# EAGLE design CC2652P_STICK_v1.1 (EAGLE 9.6.2)
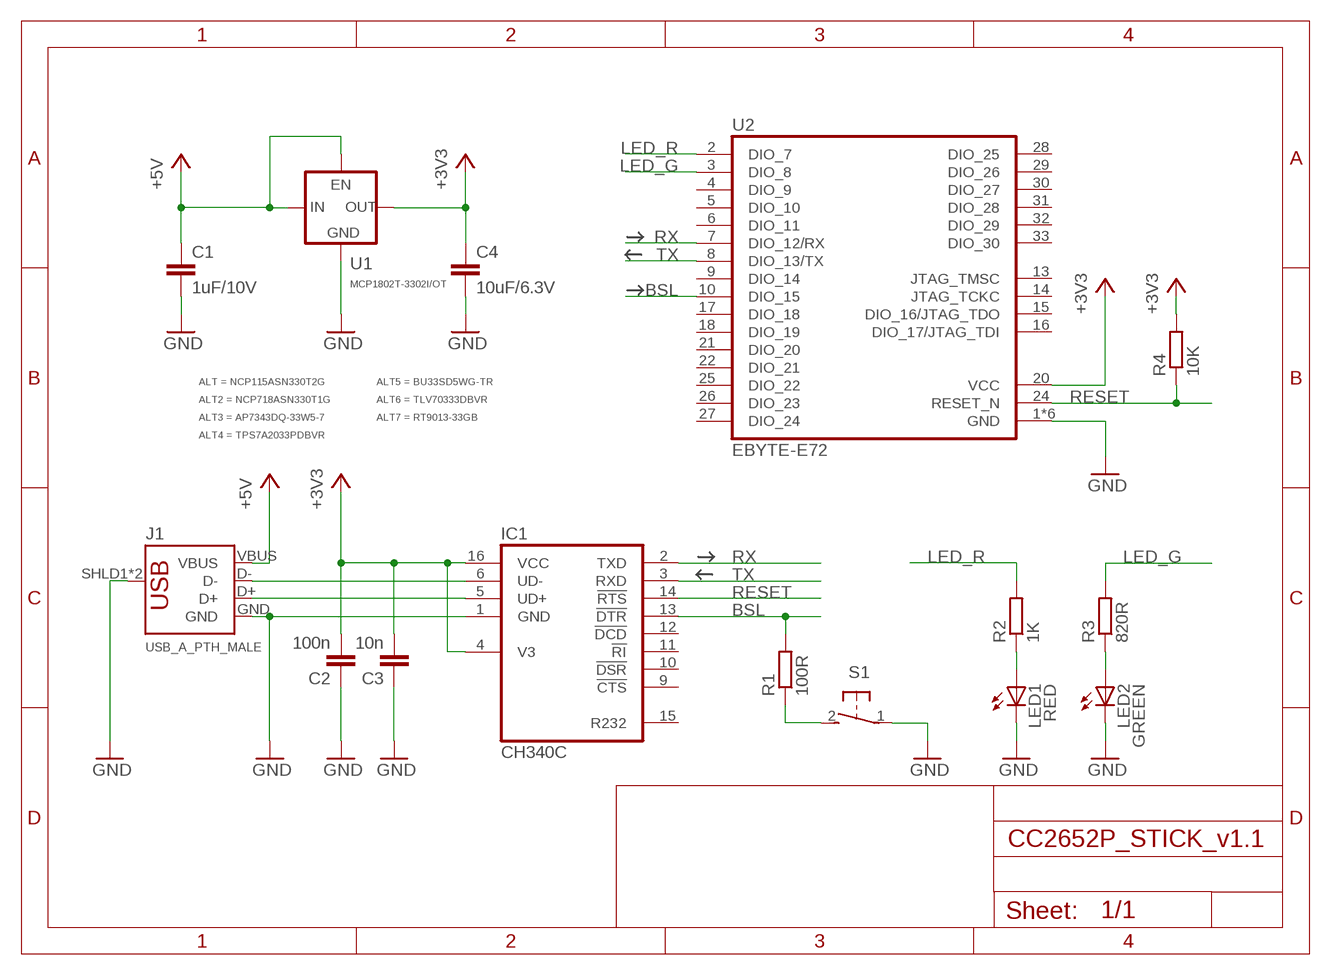
[diagram p0: schematic, sheet 1]

## Parts
C1  1uF/10V  C-EUC0805  [C0805]
C2  100n  C-EUC0805  [C0805]
C3  10n  C-EUC0805  [C0805]
C4  10uF/6.3V  C-EUC0805  [C0805]
IC1  CH340C  [SO16]
J1  USB_A_PTH_MALE  [USB-A-H]
LED1  RED  LED0603  [LED0603]
LED2  GREEN  LED0603  [LED0603]
R1  100R  R-EU_R0805  [R0805]
R2  1K  R-EU_R0805  [R0805]
R3  820R  R-EU_R0805  [R0805]
R4  10K  R-EU_R0805  [R0805]
S1  DTSM-3  [DTSM-3]
U1  MCP1802T-3302I/OT  TLV70033DD  [SOT23-5]
U2  EBYTE-E72  [EBYTE-E72]

## Nets
+3V3: C2.2 C3.2 C4.1 IC1.4(V3) IC1.16(VCC) R4.2 U1.5(VOUT) U2.20(VCC)
+5V: C1.1 J1.VBUS U1.1(VIN) U1.3(EN)
BSL: IC1.13(!DTR) R1.2 U2.10(DIO_15)
DN: IC1.6(UD-) J1.D-
DP: IC1.5(UD+) J1.D+
GND: C1.2 C2.1 C3.1 C4.2 IC1.1(GND) J1.GND J1.SHLD1(SHIELD) J1.SHLD2(SHIELD) LED1.C LED2.C S1.1 U1.2(GND) U2.1(GND) U2.11(GND) U2.12(GND) U2.19(GND) U2.23(GND) U2.34(GND)
LED_G: R3.2 U2.3(DIO_8)
LED_R: R2.2 U2.2(DIO_7)
N$1: LED2.A R3.1
N$2: LED1.A R2.1
N$3: R1.1 S1.2
RESET: IC1.14(!RTS) R4.1 U2.24(RESET_N)
RX: IC1.2(TXD) U2.7(DIO_12/RX)
TX: IC1.3(RXD) U2.8(DIO_13/TX)
Unconnected: IC1.9(!CTS) IC1.10(!DSR) IC1.11(!RI) IC1.12(!DCD) IC1.15(R232) U2.4(DIO_9) U2.5(DIO_10) U2.6(DIO_11) U2.9(DIO_14) U2.13(JTAG_TMSC) U2.14(JTAG_TCKC) U2.15(DIO_16/JTAG_TDO) U2.16(DIO_17/JTAG_TDI) U2.17(DIO_18) U2.18(DIO_19) U2.21(DIO_20) U2.22(DIO_21) U2.25(DIO_22) U2.26(DIO_23) U2.27(DIO_24) U2.28(DIO_25) U2.29(DIO_26) U2.30(DIO_27) U2.31(DIO_28) U2.32(DIO_29) U2.33(DIO_30)

## Library data of the parts
C1-C4 = rcl:C-EU: CAPACITOR, European symbol; SPICEPREFIX: C
IC1 = my-ic-usb:CH340C: USB 2.0 to Serial built-in crystal; PROD_ID: IC-13498; VALUE: CH340G
J1 = SparkFun-Connectors:USB_A: USB-A Connector Male and female variants, as well as PTH and SMT variants SparkFun Products: SparkFun XBee Explorer Dongle <https://www.sparkfun.com/products/11697> PTH Male SparkFun MicroView-USB Programmer <https://www.sparkfun.com/products/12924> SMT Male SparkFun USB Type A Female Breakout <https://www.sparkfun.com/products/12700> SMT Female; PROD_ID: CONN-08367; SF_ID: PRT-00437
LED1 LED2 = my-opto:LED
R1-R4 = rcl:R-EU_: RESISTOR, European symbol; SPICEPREFIX: R
S1 = my-switch:DTSM-3
U1 = my-power:TLV700*: LDO regulator 200mA; ALT: NCP115ASN330T2G; ALT2: NCP718ASN330T1G; ALT3: AP7343DQ-33W5-7; ALT4: TPS7A2033PDBVR; ALT5: BU33SD5WG-TR; ALT6: TLV70333DBVR; ALT7: RT9013-33GB
U2 = my-modules:EBYTE-E72: CC2652P Multifunctional SoC wireless module

## Board
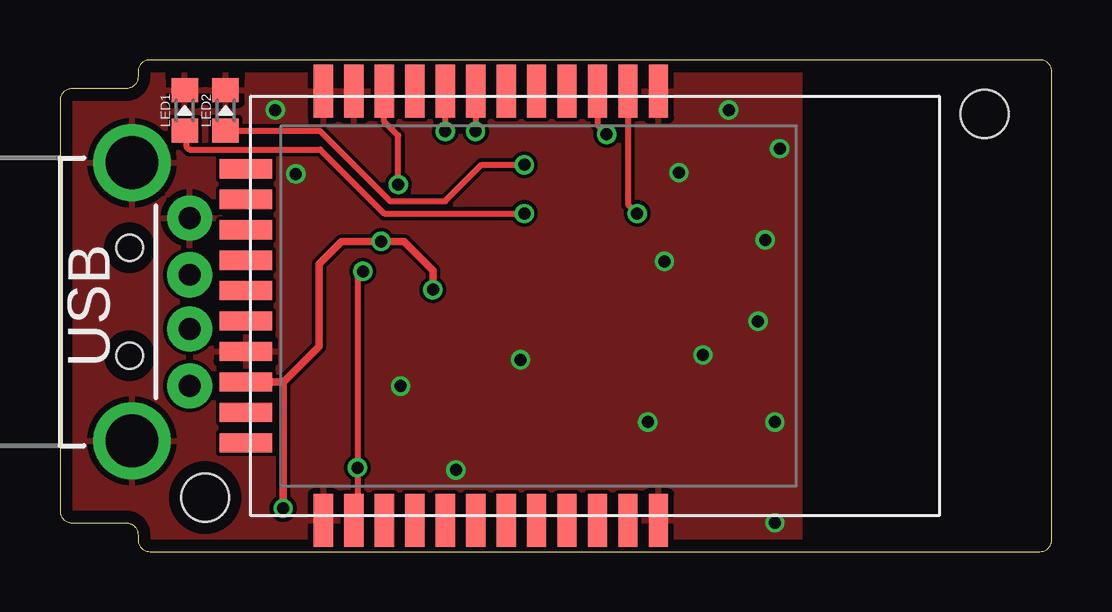
[diagram p1: board, top side]
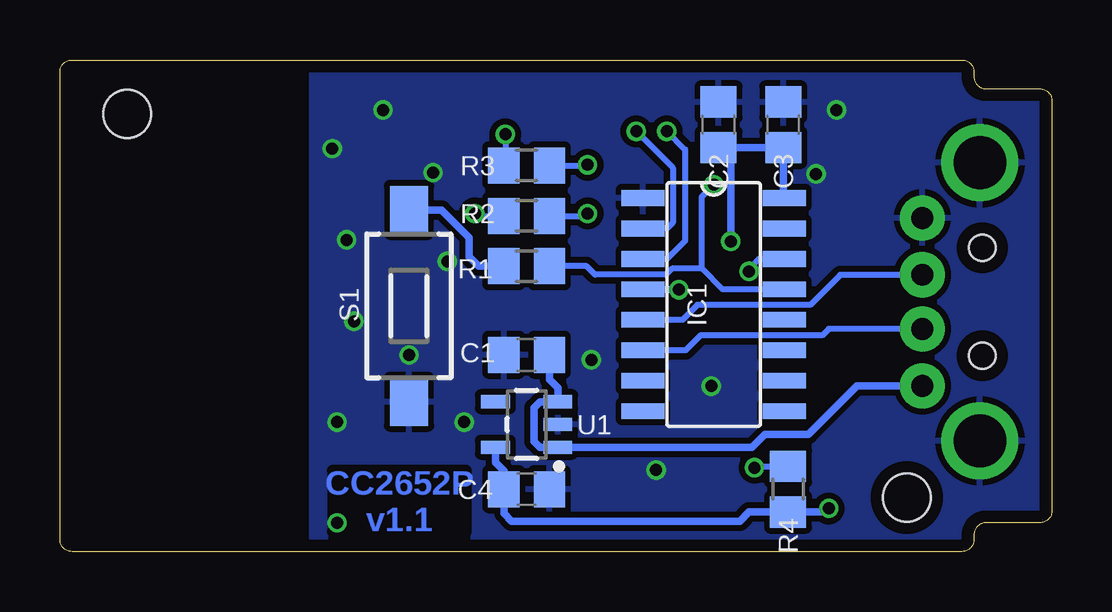
[diagram p2: board, bottom side, seen from below]

Size 41.35 x 20.5 mm. Coordinates in mm from the lower left corner, seen from the top.
Outline: 41.35,20 arc90 40.85,20.5 3.75,20.5 arc90 3.25,20 3.25,19.8 arc-90 2.75,19.3 0.5,19.3 arc90 0,18.8 0,1.7 arc90 0.5,1.2 2.75,1.2 arc-90 3.25,0.7 3.25,0.5 arc90 3.75,0 40.85,0 arc90 41.35,0.5 41.35,20
Copper layers (1*16): Top 0.035mm / dielectric 1.6mm / Bottom 0.035mm
Design rules "Elecrow_2-layer_optimal_PCB_eagle_rule *": minimum track width 6mil, minimum drill 12mil, track to track 6mil, track to pad 6mil, pad to pad 6mil, via to via 8mil, smd to smd 0mil, copper to edge 20mil, drill to drill 10mil, minimum pad ring 10mil, minimum via ring 6mil, stop-mask expansion 0mil, vias tented up to drill 100mil, thermal gap 10mil
Holes 2 mm at 6.05,2.25 38.55,18.25
tKeepout: area 36.7,16.4 to 40.4,20.1; area 4.2,0.4 to 7.9,4.1

### Footprints (pad centres in the part's own frame; a part is rotated, then mirrored left to right if it is on the bottom)
C0805 = smd 1.3 x 1.5: 1 -0.95,0; 2 0.95,0
SO16 = smd 0.66 x 1.778: 1 -4.445,-2.946; 2 -3.175,-2.946; 3 -1.905,-2.946; 4 -0.635,-2.946; 5 0.635,-2.946; 6 1.905,-2.946; 7 3.175,-2.946; 8 4.445,-2.946; 9 4.445,2.946; 10 3.175,2.946; 11 1.905,2.946; 12 0.635,2.946; 13 -0.635,2.946; 14 -1.905,2.946; 15 -3.175,2.946; 16 -4.445,2.946
USB-A-H = drill 0.914 pad 1.88: D+ 2.4,1.127; D- 2.4,-1.127; GND 2.4,3.5; VBUS 2.4,-3.5 | drill 2.2: SHLD1 0,-5.8; SHLD2 0,5.8 | hole 1.1: -0.1,2.25; -0.1,-2.25
LED0603 = smd 1.1 x 1: A 0,-0.85; C 0,0.85
R0805 = smd 1.3 x 1.5: 1 -0.95,0; 2 0.95,0
DTSM-3 = smd 2 x 1.6: 1 -4,0; 2 4,0
SOT23-5 = smd 1.2 x 0.55: 1 -1.3,0.95; 2 -1.3,0; 3 -1.3,-0.95; 4 1.3,-0.95; 5 1.3,0.95
EBYTE-E72 = smd 2.2 x 0.8: 1 8.95,-2.65; 2 8.95,-1.38; 3 8.95,-0.11; 4 8.95,1.16; 5 8.95,2.43; 6 8.95,3.7; 7 8.95,4.97; 8 8.95,6.24; 9 8.95,7.51; 10 8.95,8.78; 11 8.95,10.05; 12 8.95,11.32; 23 -8.95,11.32; 24 -8.95,10.05; 25 -8.95,8.78; 26 -8.95,7.51; 27 -8.95,6.24; 28 -8.95,4.97; 29 -8.95,3.7; 30 -8.95,2.43; 31 -8.95,1.16; 32 -8.95,-0.11; 33 -8.95,-1.38; 34 -8.95,-2.65 | smd 0.8 x 2.2: 13 5.71,14.55; 14 4.44,14.55; 15 3.17,14.55; 16 1.9,14.55; 17 0.63,14.55; 18 -0.64,14.55; 19 -1.91,14.55; 20 -3.18,14.55; 21 -4.45,14.55; 22 -5.72,14.55

### Placement (x,y rotation side)
C1  21.9,8.2 180 bottom
C2  13.9,17.8 270 bottom
C3  11.2,17.8 270 bottom
C4  21.9,2.6 0 bottom
IC1  14.1,10.3 270 bottom
J1  3,10.41 0 top
LED1  5.2,18.4 0 top
LED2  6.9,18.4 0 top
R1  21.9,11.9 0 bottom
R2  21.9,14 180 bottom
R3  21.9,16.1 180 bottom
R4  11,2.6 270 bottom
S1  26.8,10.25 90 bottom
U1  21.9,5.3 180 bottom
U2  22.3,10.25 90 top

### Tracks (layer width: path | path; a pad name or v marks a point on that pad's centre or on a via)
+3V3  (via drill 0.5)
  Top 0.305: v15.55,10.92 15.55,11.72 14.34,12.94 v13.39,12.94 11.73,12.94 10.8,12 10.8,8.54 9.32,7.07 9.3,7.07 | U2.20 9.3,7.07 | 9.3,7.07 v9.3,1.8
  Bottom 0.305: v9.3,1.8 9.45,1.65 R4.2 12.63,1.65 13.01,1.27 22.53,1.27 22.85,1.59 C4.1 22.85,3.37 23.2,3.71 U1.5 | IC1.16 11.2,14.79 C3.2 C2.2 13.9,16.77 13.39,16.26 v13.39,12.94 | IC1.4 15.56,10.94 v15.55,10.92
+5V
  Bottom 0.305: C1.1 20.95,7.18 20.6,6.83 U1.3 21.35,6.25 21.6,6 21.6,4.6 21.35,4.35 U1.1 12.5,4.35 11.96,4.89 10.15,4.89 8.13,6.91 J1.VBUS
BSL  (via drill 0.5)
  Top 0.254: v14.1,15.3 14.1,17.35 13.52,17.93 U2.10
  Bottom 0.254: R1.2 19.4,11.9 19.05,11.54 16.09,11.54 15.84,11.8 14.6,11.8 | IC1.13 13.73,10.94 14.6,11.8 | 14.6,11.8 14.6,14.8 v14.1,15.3
DN
  Bottom 0.254: IC1.6 15.27,8.39 14.65,9.02 9.57,9.02 9.3,9.29 J1.D-
DP
  Bottom 0.254: J1.D+ 8.82,11.54 10.08,10.29 14.78,10.29 15.4,9.66 IC1.5
GND  (via drill 0.5)
  other vias: 25.2,12.1 24.5,5.4 26.8,8.2 29.8,5.4 29.1,9.6 29.4,13 25.8,15.8 30,16.8 27.88,18.41 29.8,1.2 9.83,15.75 19.2,8 14.2,6.9 16.5,3.4 8.98,18.41
  pour Bottom (isolate 0.254): 2.75,19.3 0.5,19.3 arc90 0,18.8 0,1.7 arc90 0.5,1.2 2.75,1.2 arc-90 3.25,0.7 3.25,0.5 arc90 3.75,0 30.85,0 30.85,20.5 3.75,20.5 arc90 3.25,20 3.25,19.8 arc-90
  pour Top: 2.75,19.3 0.5,19.3 arc90 0,18.8 0,1.7 arc90 0.5,1.2 2.75,1.2 arc-90 3.25,0.7 3.25,0.5 arc90 3.75,0 30.85,0 30.85,20.5 3.75,20.5 arc90 3.25,20 3.25,19.8 arc-90
LED_G  (via drill 0.5)
  Top 0.254: U2.3 22.41,17.78 v22.79,17.4
  Bottom 0.254: v22.79,17.4 22.79,16.16 R3.2
LED_R  (via drill 0.5)
  Top 0.254: U2.2 23.68,14.47 v24.06,14.1
  Bottom 0.254: v24.06,14.1 23.96,14 R2.2
N$1  (via drill 0.5)
  Top 0.254: LED2.A 10.82,17.55 13.77,14.61 16.06,14.61 17.58,16.13 v19.36,16.13
  Bottom 0.254: v19.36,16.13 19.39,16.1 R3.1
N$2  (via drill 0.5)
  Top 0.254: LED1.A 5.26,17.49 5.26,16.89 5.39,16.76 10.85,16.76 13.52,14.1 v19.36,14.1
  Bottom 0.254: v19.36,14.1 19.45,14 R2.1
N$3
  Bottom 0.305: R1.1 23.9,11.9 24.3,12.3 24.3,13.1 25.45,14.25 S1.2
RESET  (via drill 0.5)
  Top 0.254: U2.24 12.4,1.45 v12.4,3.5 12.4,11.46 v12.63,11.68
  Bottom 0.254: v12.63,11.68 12.63,11.79 12.21,12.21 IC1.14 | v12.4,3.5 12.35,3.55 R4.1
RX  (via drill 0.5)
  Top 0.254: U2.7 v17.33,17.53
  Bottom 0.254: v17.33,17.53 15.8,16 15.8,13.72 16.04,13.47 IC1.2
TX  (via drill 0.5)
  Top 0.254: U2.8 v16.06,17.53
  Bottom 0.254: IC1.3 16.04,12.21 15.29,12.95 15.29,16.76 v16.06,17.53

### Text on the board
Bottom: CC2652P / v1.1
tPlace: USB
bStop: CC2652P / v1.1
Reference: JLCJLCJLCJLC